# EAGLE schematic TestFanControl (EAGLE 6.1)
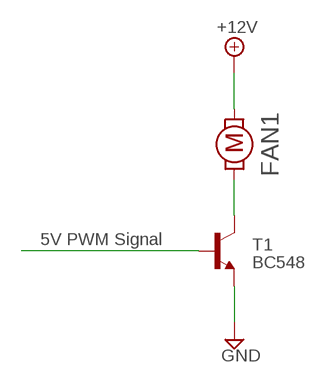
[diagram p0: schematic, sheet 1]

## Parts
FAN1  FAN  [1X02]
T1  BC548  BC547  [TO92]

## Nets
+12V: FAN1.2
GND: T1.1(E)
N$2: FAN1.1 T1.3(C)
N$8: T1.2(B)

## Notes on the sheet
- 5V PWM Signal

## Library data of the parts
FAN1 = EnigmaMon:FAN
T1 = transistor:BC547: NPN TRANSISTOR